# Altium schematic sheet MOTOR_DRIVER.SchDoc
size 594 x 419 mm
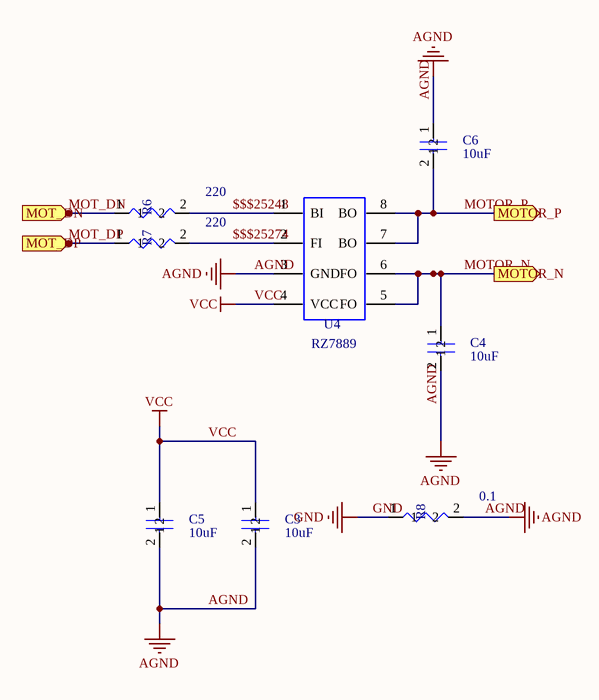
[diagram p0: MOTOR_DRIVER.SchDoc]

## Parts
C3  value 10uF  (hidden comment: EC0603)
C4  value 10uF  (hidden comment: EC0603)
C5  value 10uF  (hidden comment: EC0603)
C6  value 10uF  (hidden comment: EC0603)
R6  value 220  (hidden comment: RESISTOR)
R7  value 220  (hidden comment: RESISTOR)
R8  value 0.1  (hidden comment: RESISTOR)
U4  RZ7889

## Ports
MOT_DN, MOT_DP, MOTOR_N, MOTOR_P

## Nets
AGND: C3.2 C4.2 C5.2 C6.1 R8.2 U4.3(GND)
GND: R8.1
VCC: C3.1 C5.1 U4.4(VCC)
$$$25248: R6.2 U4.1(BI)
$$$25274: R7.2 U4.2(FI)
MOT_DN: R6.1 ; port MOT_DN
MOT_DP: R7.1 ; port MOT_DP
MOTOR_N: C4.1 U4.5(FO) U4.6(FO) ; port MOTOR_N
MOTOR_P: C6.2 U4.7(BO) U4.8(BO) ; port MOTOR_P

## Library data of the parts
C3-C6 = EC0603: Source_Path: E:\LIB\LIBRARY1.OLB; PAGE: 1; PCB DECAL: C0603
R6 R7 = RESISTOR: RES,thick film,47KOhm,+/-5%,1/16W,SMD0402; Source_Path: E:\COMPANY\ORCAD\RK2908\7_PMU\DS722_RK2918_ONE0907.DSN; PCB DECAL: ER0603
R8 = RESISTOR: RES,thick film,47KOhm,+/-5%,1/16W,SMD0402; Source_Path: E:\COMPANY\ORCAD\RK2908\7_PMU\DS722_RK2918_ONE0907.DSN; PCB DECAL: R2010
U4 = RZ7889: PCB DECAL: RZ7889